# Altium schematic sheet Top.SchDoc
size A4
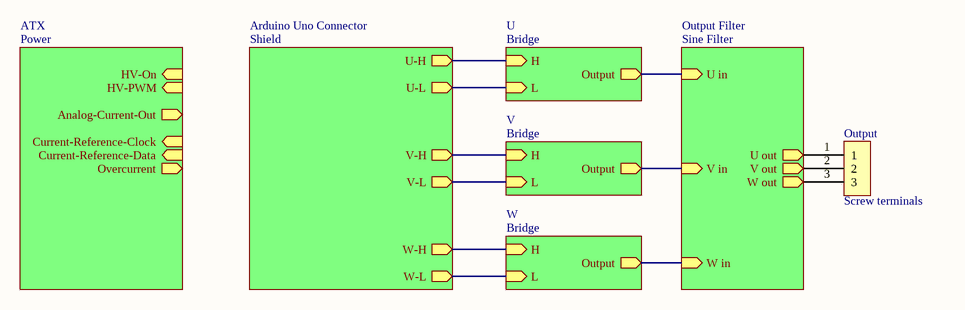
[diagram p0: Top.SchDoc]

## Parts
Output  Screw terminals  [DG301-5.0-03]

## Sub-sheets
Arduino Uno Connector = Shield: V-H (out), U-H (out), U-L (out), V-L (out), W-H (out), W-L (out)
ATX = Power: HV-On (in), HV-PWM (in), Current-Reference-Clock (in), Current-Reference-Data (in), Overcurrent (out), Analog-Current-Out (out)
Output Filter = Sine Filter: W out (out), V out (out), U out (out), W in (in), V in (in), U in (in)
U = Bridge: H (in), L (in), Output (out)
V = Bridge: H (in), L (in), Output (out)
W = Bridge: H (in), L (in), Output (out)

## Nets
NetOutput_1: Output.1 ; sheet Output Filter/U out
NetOutput_2: Output.2 ; sheet Output Filter/V out
NetOutput_3: Output.3 ; sheet Output Filter/W out
(unnamed): sheet U/H, sheet Arduino Uno Connector/U-H
(unnamed): sheet U/L, sheet Arduino Uno Connector/U-L
(unnamed): sheet U/Output, sheet Output Filter/U in
(unnamed): sheet V/H, sheet Arduino Uno Connector/V-H
(unnamed): sheet V/L, sheet Arduino Uno Connector/V-L
(unnamed): sheet V/Output, sheet Output Filter/V in
(unnamed): sheet W/H, sheet Arduino Uno Connector/W-H
(unnamed): sheet W/L, sheet Arduino Uno Connector/W-L
(unnamed): sheet W/Output, sheet Output Filter/W in

## Library data of the parts
Output = Header 1x3